# Altium schematic sheet Core.SchDoc
size 177 x 381 mm
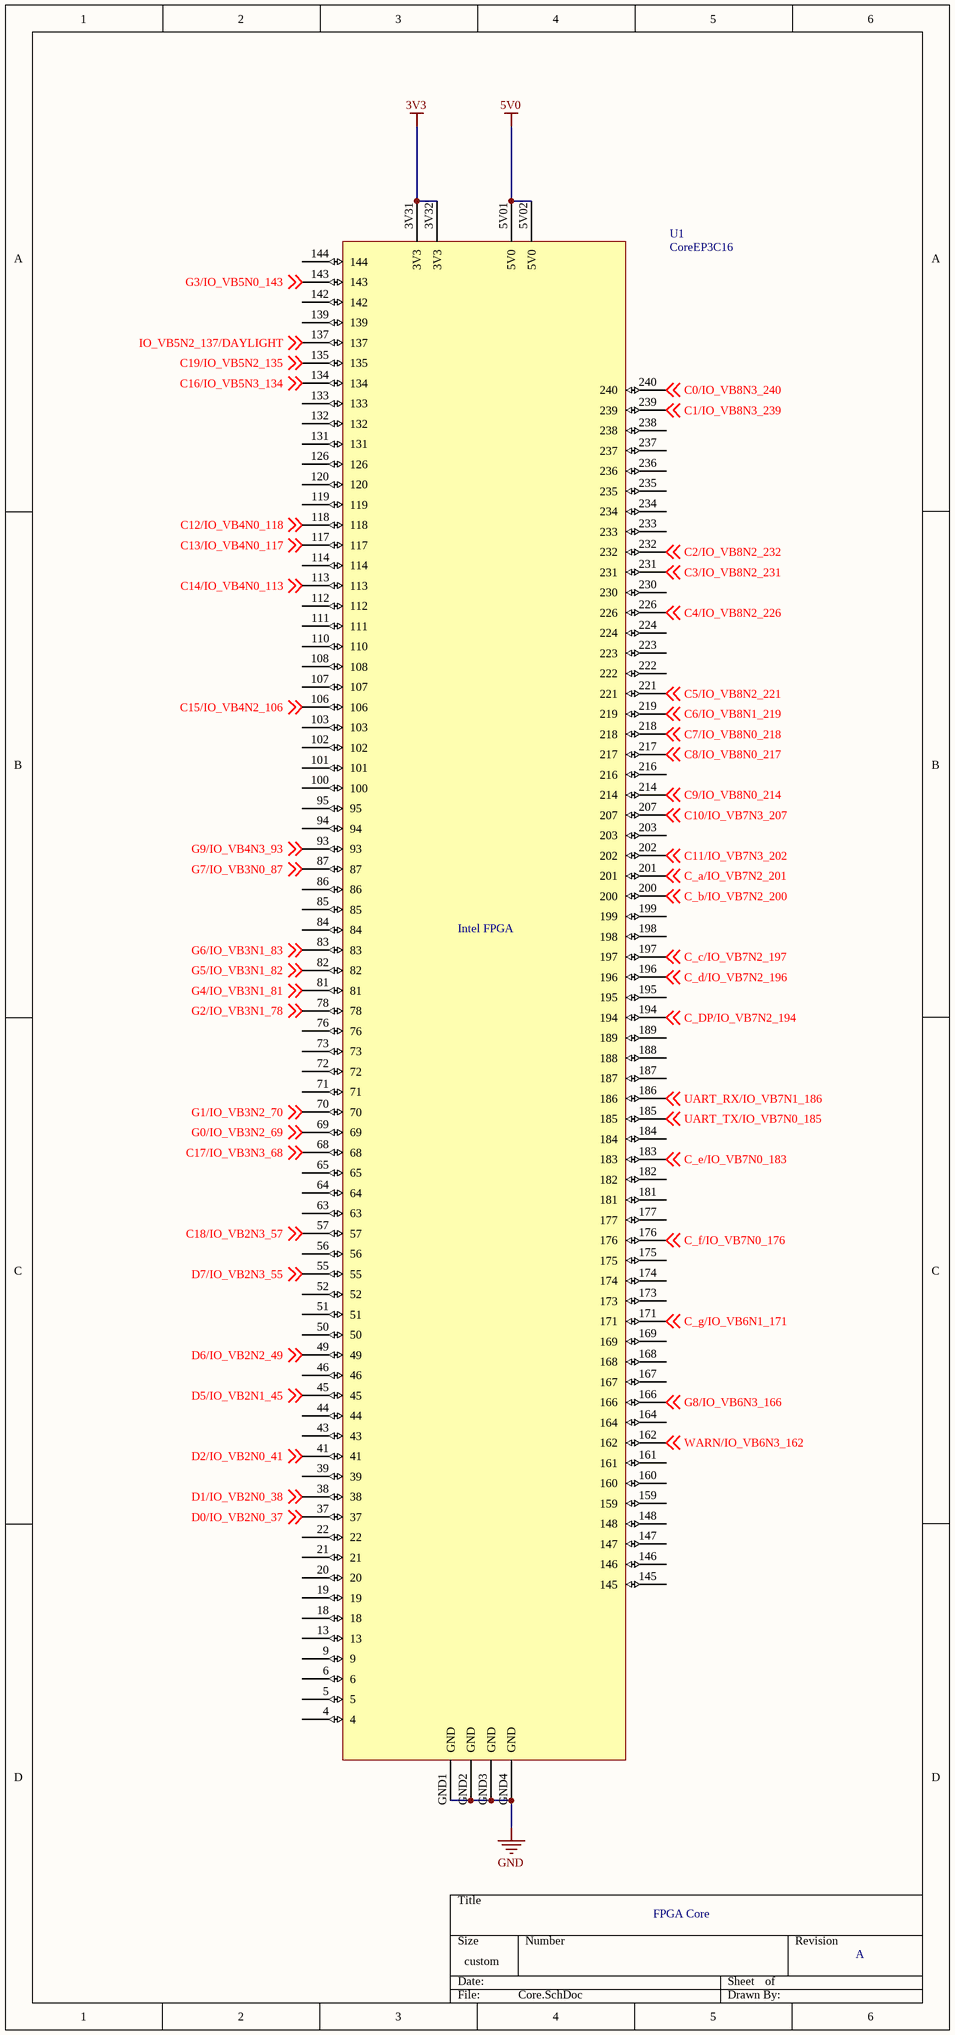
[diagram p0: Core.SchDoc]

## Parts
U1  CoreEP3C16  [COREEP3C16]

## Nets
3V3: U1.3V31(3V3) U1.3V32(3V3)
5V0: U1.5V01(5V0) U1.5V02(5V0)
GND: U1.GND1(GND) U1.GND2(GND) U1.GND3(GND) U1.GND4(GND)
C0/IO_VB8N3_240: U1.240 ; off-sheet C0/IO_VB8N3_240
C1/IO_VB8N3_239: U1.239 ; off-sheet C1/IO_VB8N3_239
C2/IO_VB8N2_232: U1.232 ; off-sheet C2/IO_VB8N2_232
C3/IO_VB8N2_231: U1.231 ; off-sheet C3/IO_VB8N2_231
C4/IO_VB8N2_226: U1.226 ; off-sheet C4/IO_VB8N2_226
C5/IO_VB8N2_221: U1.221 ; off-sheet C5/IO_VB8N2_221
C6/IO_VB8N1_219: U1.219 ; off-sheet C6/IO_VB8N1_219
C7/IO_VB8N0_218: U1.218 ; off-sheet C7/IO_VB8N0_218
C8/IO_VB8N0_217: U1.217 ; off-sheet C8/IO_VB8N0_217
C9/IO_VB8N0_214: U1.214 ; off-sheet C9/IO_VB8N0_214
C10/IO_VB7N3_207: U1.207 ; off-sheet C10/IO_VB7N3_207
C11/IO_VB7N3_202: U1.202 ; off-sheet C11/IO_VB7N3_202
C12/IO_VB4N0_118: U1.118 ; off-sheet C12/IO_VB4N0_118
C13/IO_VB4N0_117: U1.117 ; off-sheet C13/IO_VB4N0_117
C14/IO_VB4N0_113: U1.113 ; off-sheet C14/IO_VB4N0_113
C15/IO_VB4N2_106: U1.106 ; off-sheet C15/IO_VB4N2_106
C16/IO_VB5N3_134: U1.134 ; off-sheet C16/IO_VB5N3_134
C17/IO_VB3N3_68: U1.68 ; off-sheet C17/IO_VB3N3_68
C18/IO_VB2N3_57: U1.57 ; off-sheet C18/IO_VB2N3_57
C19/IO_VB5N2_135: U1.135 ; off-sheet C19/IO_VB5N2_135
C_a/IO_VB7N2_201: U1.201 ; off-sheet C_a/IO_VB7N2_201
C_b/IO_VB7N2_200: U1.200 ; off-sheet C_b/IO_VB7N2_200
C_c/IO_VB7N2_197: U1.197 ; off-sheet C_c/IO_VB7N2_197
C_d/IO_VB7N2_196: U1.196 ; off-sheet C_d/IO_VB7N2_196
C_DP/IO_VB7N2_194: U1.194 ; off-sheet C_DP/IO_VB7N2_194
C_e/IO_VB7N0_183: U1.183 ; off-sheet C_e/IO_VB7N0_183
C_f/IO_VB7N0_176: U1.176 ; off-sheet C_f/IO_VB7N0_176
C_g/IO_VB6N1_171: U1.171 ; off-sheet C_g/IO_VB6N1_171
D0/IO_VB2N0_37: U1.37 ; off-sheet D0/IO_VB2N0_37
D1/IO_VB2N0_38: U1.38 ; off-sheet D1/IO_VB2N0_38
D2/IO_VB2N0_41: U1.41 ; off-sheet D2/IO_VB2N0_41
D5/IO_VB2N1_45: U1.45 ; off-sheet D5/IO_VB2N1_45
D6/IO_VB2N2_49: U1.49 ; off-sheet D6/IO_VB2N2_49
D7/IO_VB2N3_55: U1.55 ; off-sheet D7/IO_VB2N3_55
G0/IO_VB3N2_69: U1.69 ; off-sheet G0/IO_VB3N2_69
G1/IO_VB3N2_70: U1.70 ; off-sheet G1/IO_VB3N2_70
G2/IO_VB3N1_78: U1.78 ; off-sheet G2/IO_VB3N1_78
G3/IO_VB5N0_143: U1.143 ; off-sheet G3/IO_VB5N0_143
G4/IO_VB3N1_81: U1.81 ; off-sheet G4/IO_VB3N1_81
G5/IO_VB3N1_82: U1.82 ; off-sheet G5/IO_VB3N1_82
G6/IO_VB3N1_83: U1.83 ; off-sheet G6/IO_VB3N1_83
G7/IO_VB3N0_87: U1.87 ; off-sheet G7/IO_VB3N0_87
G8/IO_VB6N3_166: U1.166 ; off-sheet G8/IO_VB6N3_166
G9/IO_VB4N3_93: U1.93 ; off-sheet G9/IO_VB4N3_93
IO_VB5N2_137/DAYLIGHT: U1.137 ; off-sheet IO_VB5N2_137/DAYLIGHT
UART_RX/IO_VB7N1_186: U1.186 ; off-sheet UART_RX/IO_VB7N1_186
UART_TX/IO_VB7N0_185: U1.185 ; off-sheet UART_TX/IO_VB7N0_185
WARN/IO_VB6N3_162: U1.162 ; off-sheet WARN/IO_VB6N3_162

Not connected (* = marked no-connect by the designer): U1 4 5 6 9 13 18 19 20 21 22 39 43 44 46 50 51 52 56 63 64 65 71 72 73 76 84 85 86 94 95 100 101 102 103 107 108 110 111 112 114 119 120 126 131 132 133 139 142 144 145 146 147 148 159 160 161 164 167 168 169 173 174 175 177 181 182 184 187 188 189 195 198 199 203 216 222 223 224 230 233 234 235 236 237 238

## Notes on the sheet
- FPGA Core
- A
- (in symbol CoreEP3C16) Intel FPGA

## Library data of the parts
U1 = CoreEP3C16: Intel FPGA Core